# EAGLE design with_usb_small_smd (EAGLE 8.3.2)
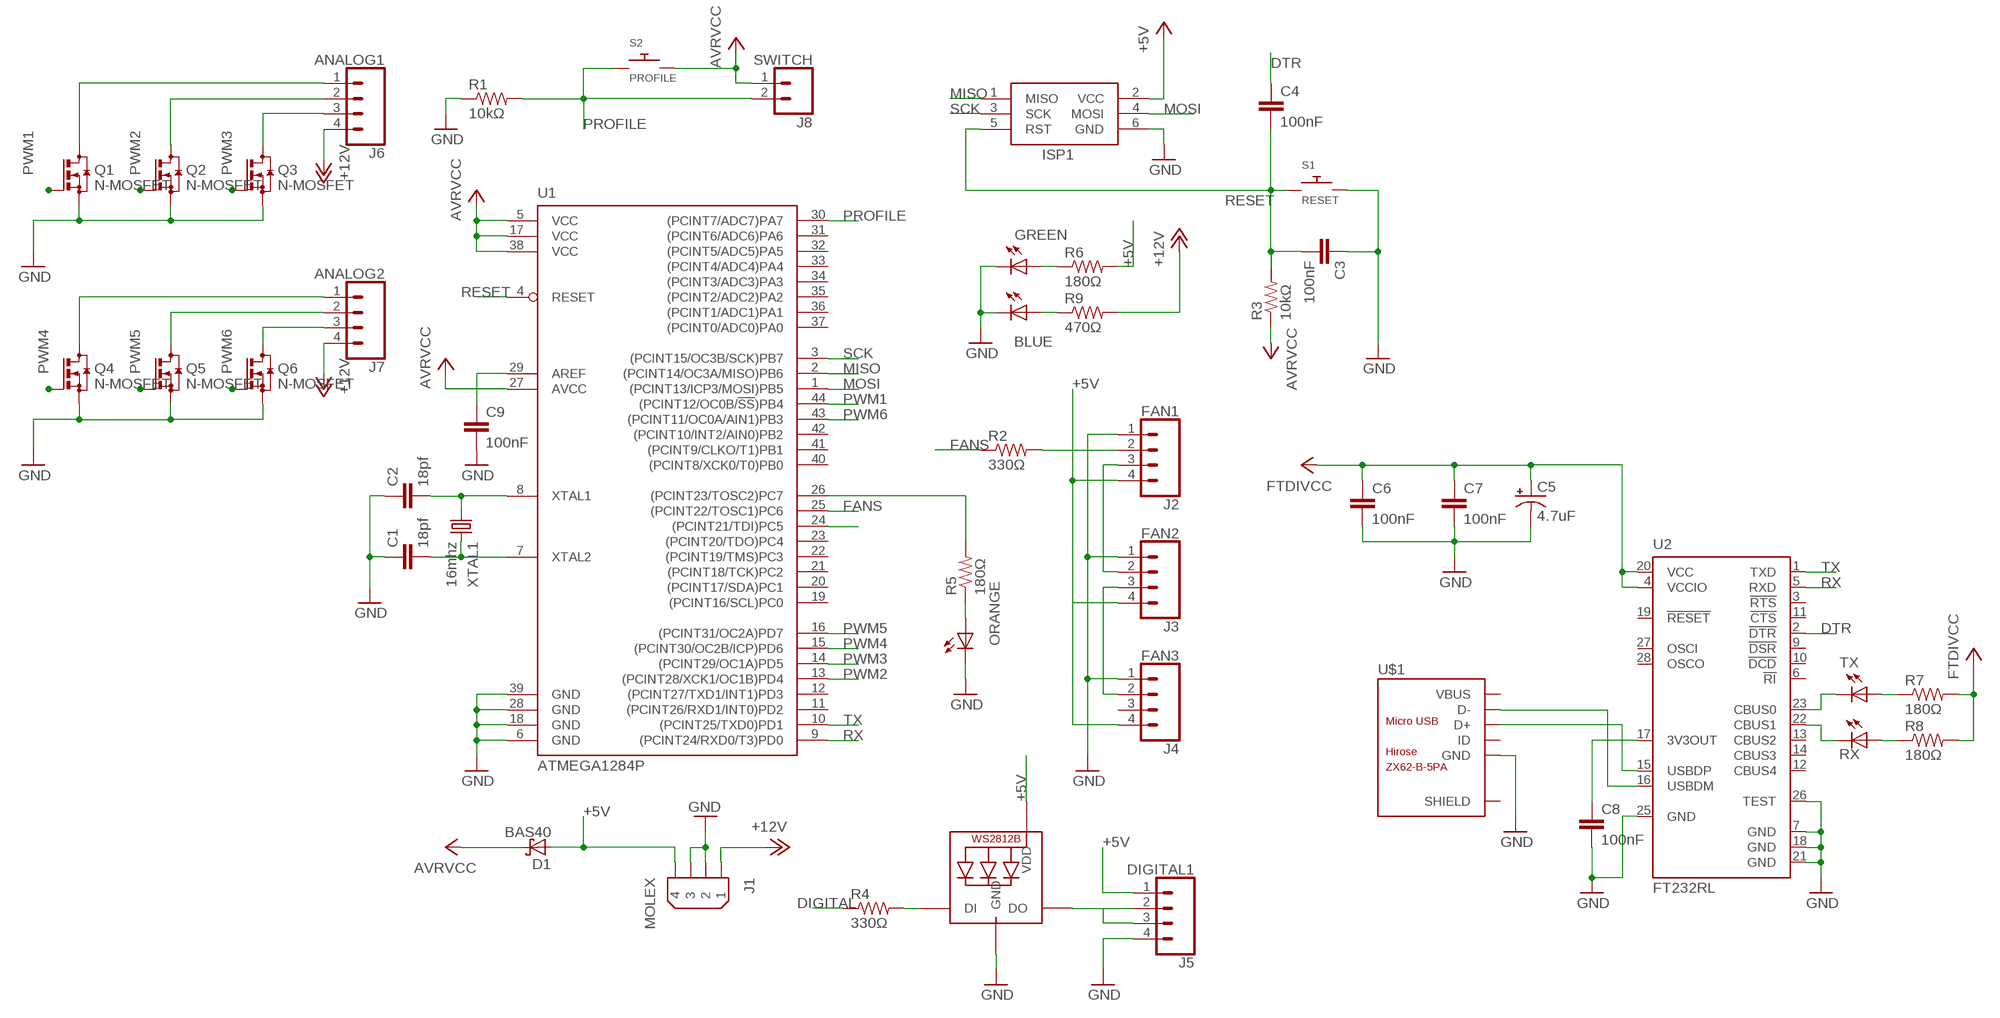
[diagram p0: schematic, sheet 1]

## Parts
C1  18pf  C-EUC0805  [C0805]
C2  18pf  C-EUC0805  [C0805]
C3  100nF  C-EUC0805  [C0805]
C4  100nF  C-EUC0805  [C0805]
C5  4.7uF  CPOL-US153CLV-0405  [153CLV-0405]
C6  100nF  C-EUC0805  [C0805]
C7  100nF  C-EUC0805  [C0805]
C8  100nF  C-EUC0805  [C0805]
C9  100nF  C-EUC0805  [C0805]
D1  BAS40  [SOT23]
ISP1  AVRISP-6  [AVRISP]
J1  MOLEX  9090-4R  [9090-4R]
J2  FAN1  TJC8-4P  [TJC8-4P]
J3  FAN2  TJC8-4P  [TJC8-4P]
J4  FAN3  TJC8-4P  [TJC8-4P]
J5  DIGITAL1  MX-22-05-3041  [MX-22-05-3041]
J6  ANALOG1  MX-22-05-3041  [MX-22-05-3041]
J7  ANALOG2  MX-22-05-3041  [MX-22-05-3041]
J8  SWITCH  TE-280377-1  [TE-280377-1]
LED1  TX  LEDSML0805  [SML0805]
LED2  RX  LEDSML0805  [SML0805]
LED3  GREEN  LEDSML0805  [SML0805]
LED4  BLUE  LEDSML0805  [SML0805]
LED5  ORANGE  LEDSML0805  [SML0805]
LED6  WS2812B  [WS2812B]
Q1  N-MOSFET  [SOT23]
Q2  N-MOSFET  [SOT23]
Q3  N-MOSFET  [SOT23]
Q4  N-MOSFET  [SOT23]
Q5  N-MOSFET  [SOT23]
Q6  N-MOSFET  [SOT23]
R1  10kΩ  R-US_R0805  [R0805]
R2  330Ω  R-US_R0805  [R0805]
R3  10kΩ  R-US_R0805  [R0805]
R4  330Ω  R-US_R0805  [R0805]
R5  180Ω  R-US_R0805  [R0805]
R6  180Ω  R-US_R0805  [R0805]
R7  180Ω  R-US_R0805  [R0805]
R8  180Ω  R-US_R0805  [R0805]
R9  470Ω  R-US_R0805  [R0805]
S1  RESET  BUTTON  [B3F-1000]
S2  PROFILE  BUTTON  [B3F-1000]
U1  ATMEGA1284P  ATMEGA1284P-AU  [TQFP44]
U2  FT232RL  [SSOP28]
U$1  MICRO_USB  [MICRO_USB]
XTAL1  16mhz  CRYSTALHC49U-V  [HC49U-V]

## Nets
+5V: C5.+ C6.1 C7.1 D1.1(A) J1.4 J2.4 J3.4 J4.4 J5.1 LED6.1-VDD(VDD) R6.2 R7.2 R8.2 U2.4(VCCIO) U2.20(VCC) ; supply symbol labelled FTDIVCC
+12V: J1.1 J6.4 J7.4 R9.2
AVR: D1.3(C) ISP1.2(VCC) J8.1 R3.1 S2.3 S2.4 U1.5(VCC) U1.17(VCC) U1.27(AVCC) U1.38(VCC) ; supply symbol labelled AVRVCC, +5V
D+: U2.15(USBDP) U$1.3(D+)
D-: U2.16(USBDM) U$1.2(D-)
DIGITAL: R4.1 U1.24((PCINT21/TDI)PC5)
DIN-D: J5.2 J5.3 LED6.2-DOUT(DO)
DTR: C4.1 U2.2(!DTR)
F1-DIN: J2.2 R2.2
F2-DIN: J2.3 J3.2
F3-DIN: J3.3 J4.2
FANS: R2.1 U1.25((PCINT22/TOSC1)PC6)
GND: C1.1 C2.1 C3.1 C5.- C6.2 C7.2 C8.2 C9.2 ISP1.6(GND) J1.2 J1.3 J2.1 J3.1 J4.1 J5.4 LED3.C LED4.C LED5.C LED6.3-GND(GND) Q1.2(S) Q2.2(S) Q3.2(S) Q4.2(S) Q5.2(S) Q6.2(S) R1.1 S1.3 S1.4 U1.6(GND) U1.18(GND) U1.28(GND) U1.39(GND) U2.7(GND) U2.18(GND) U2.21(GND) U2.25(GND) U2.26(TEST) U$1.5(GND)
LED: R5.2 U1.26((PCINT23/TOSC2)PC7)
MISO: ISP1.1(MISO) U1.2((PCINT14/OC3A/MISO)PB6)
MOSI: ISP1.4(MOSI) U1.1((PCINT13/ICP3/MOSI)PB5)
N$2: LED1.A R7.1
N$3: C8.1 U2.17(3V3OUT)
N$4: LED2.A R8.1
N$5: LED4.A R9.1
N$6: C9.1 U1.29(AREF)
N$7: LED3.A R6.1
N$8: LED5.A R5.1
N$9: LED6.4-DIN(DI) R4.2
PROFILE: J8.2 R1.2 S2.1 S2.2 U1.30((PCINT7/ADC7)PA7)
PWM1: Q1.1(G) U1.44((PCINT12/OC0B/!SS!)PB4)
PWM2: Q2.1(G) U1.13((PCINT28/XCK1/OC1B)PD4)
PWM3: Q3.1(G) U1.14((PCINT29/OC1A)PD5)
PWM4: Q4.1(G) U1.15((PCINT30/OC2B/ICP)PD6)
PWM5: Q5.1(G) U1.16((PCINT31/OC2A)PD7)
PWM6: Q6.1(G) U1.43((PCINT11/OC0A/AIN1)PB3)
RESET: C3.2 C4.2 ISP1.5(RST) R3.2 S1.1 S1.2 U1.4(RESET)
RX: U1.9((PCINT24/RXD0/T3)PD0) U2.5(RXD)
RXLED: LED2.C U2.22(CBUS1)
S1-1: J6.1 Q1.3(D)
S1-2: J6.2 Q2.3(D)
S1-3: J6.3 Q3.3(D)
S2-1: J7.1 Q4.3(D)
S2-2: J7.2 Q5.3(D)
S2-3: J7.3 Q6.3(D)
SCK: ISP1.3(SCK) U1.3((PCINT15/OC3B/SCK)PB7)
TX: U1.10((PCINT25/TXD0)PD1) U2.1(TXD)
TXLED: LED1.C U2.23(CBUS0)
XTAL1: C2.2 U1.8(XTAL1) XTAL1.1
XTAL2: C1.2 U1.7(XTAL2) XTAL1.2
Unconnected: J4.3 U1.11((PCINT26/RXD1/INT0)PD2) U1.12((PCINT27/TXD1/INT1)PD3) U1.19((PCINT16/SCL)PC0) U1.20((PCINT17/SDA)PC1) U1.21((PCINT18/TCK)PC2) U1.22((PCINT19/TMS)PC3) U1.23((PCINT20/TDO)PC4) U1.31((PCINT6/ADC6)PA6) U1.32((PCINT5/ADC5)PA5) U1.33((PCINT4/ADC4)PA4) U1.34((PCINT3/ADC3)PA3) U1.35((PCINT2/ADC2)PA2) U1.36((PCINT1/ADC1)PA1) U1.37((PCINT0/ADC0)PA0) U1.40((PCINT8/XCK0/T0)PB0) U1.41((PCINT9/CLKO/T1)PB1) U1.42((PCINT10/INT2/AIN0)PB2) U2.3(!RTS) U2.6(!RI) U2.9(!DSR) U2.10(!DCD) U2.11(!CTS) U2.12(CBUS4) U2.13(CBUS2) U2.14(CBUS3) U2.19(!RESET) U2.27(OSCI) U2.28(OSCO) U$1.1(VBUS) U$1.4(ID) U$1.S1(SHIELD) U$1.S2(SHIELD) U$1.S3(SHIELD) U$1.S4(SHIELD) U$1.S5(SHIELD) U$1.S6(SHIELD)

## Library data of the parts
C1 C3 C4 = rcl:C-EU: CAPACITOR, European symbol
C2 C6-C9 = resistor:C-EU: CAPACITOR, European symbol
C5 = resistor:CPOL-US: POLARIZED CAPACITOR, American symbol
D1 = diode:BAS40: Silicon Schottky Diodes General-purpose diode for high-speed switching
ISP1 = my_parts:AVRISP: AVR ISP HEADER Standard 6 pin header for AVR programming
J1 = con-thomas-betts:9090-4: Disk Drive Power four position Source: Thomas & Betts Electronic Interconnects Eiropean Edition 1998; OC_FARNELL: unknown; OC_NEWARK: unknown
J2-J4 = my_parts:TJC8-4P
J5-J7 = my_parts:MX-22-05-3041
J8 = my_parts:TE-280377-1
LED1-LED5 = led:LED: LED OSRAM: - CHIPLED LG R971, LG N971, LY N971, LG Q971, LY Q971, LO R971, LY R971 LH N974, LH R974 LS Q976, LO Q976, LY Q976 LO Q996 - Hyper CHIPLED LW Q18S LB Q993, LB Q99A, LB R99A - SideLED LS A670, LO A670, LY A670, LG A670, LP A670 LB A673, LV A673, LT A673, LW A673 LH A674 LY A675 LS A676, LA A676, LO A676, LY A676, LW A676 LS A679, LY A679, LG A679 - Hyper Micro SIDELED® LS Y876, LA Y876, LO Y876, LY Y876 LT Y87S - SmartLED LW L88C, LW L88S LB L89C, LB L89S, LG L890 LS L89K, LO L89K, LY L89K LS L896, LA L896, LO L896, LY L896 - TOPLED LS T670, LO T670, LY T670, LG T670, LP T670 LSG T670, LSP T670, LSY T670, LOP T670, LYG T670 LG T671, LOG T671, LSG T671 LB T673, LV T673, LT T673, LW T673 LH T674 LS T676, LA T676, LO T676, LY T676, LB T676, LH T676, LSB T676, LW T676 LB T67C, LV T67C, LT T67C, LS T67K, LO T67K, LY T67K, LW E67C LS E67B, LA E67B, LO E67B, LY E67B, LB E67C, LV E67C, LT E67C LW T67C LS T679, LY T679, LG T679 LS T770, LO T770, LY T770, LG T770, LP T770 LB T773, LV T773, LT T773, LW T773 LH T774 LS E675, LA E675, LY E675, LS T675 LS T776, LA T776, LO T776, LY T776, LB T776 LHGB T686 LT T68C, LB T68C - Hyper Mini TOPLED® LB M676 - Mini TOPLED Santana® LG M470 LS M47K, LO M47K, LY M47K Source: http://www.osram.convergy.de LUXEON: - LUMILED® LXK2-PW12-R00, LXK2-PW12-S00, LXK2-PW14-U00, LXK2-PW14-V00 LXK2-PM12-R00, LXK2-PM12-S00, LXK2-PM14-U00 LXK2-PE12-Q00, LXK2-PE12-R00, LXK2-PE12-S00, LXK2-PE14-T00, LXK2-PE14-U00 LXK2-PB12-K00, LXK2-PB12-L00, LXK2-PB12-M00, LXK2-PB14-N00, LXK2-PB14-P00, LXK2-PB14-Q00 LXK2-PR12-L00, LXK2-PR12-M00, LXK2-PR14-Q00, LXK2-PR14-R00 LXK2-PD12-Q00, LXK2-PD12-R00, LXK2-PD12-S00 LXK2-PH12-R00, LXK2-PH12-S00 LXK2-PL12-P00, LXK2-PL12-Q00, LXK2-PL12-R00 Source: www.luxeon.com KINGBRIGHT: KA-3528ASYC Source: www.kingbright.com
LED6 = my_parts:WS2812B
Q1-Q6 = my_parts:N-MOSFET
R1-R9 = resistor:R-US_: RESISTOR, American symbol
S1 S2 = my_parts:BUTTON
U1 = my_parts:ATMEGA1284P-AU
U2 = ftdichip:FT232R: Source: http://www.ftdichip.com/Documents/DataSheets/DS_FT232R_v104.pdf; MPN: FT232RL; OC_FARNELL: 1146032; OC_NEWARK: 91K9918
U$1 = my_parts:MICRO_USB
XTAL1 = adafruit:CRYSTAL: CRYSTAL; OC_FARNELL: 1666969; OC_NEWARK: unknown

## Net classes
0 default: clearance 0.152 mm
1 GND: clearance 0.61 mm

## Board
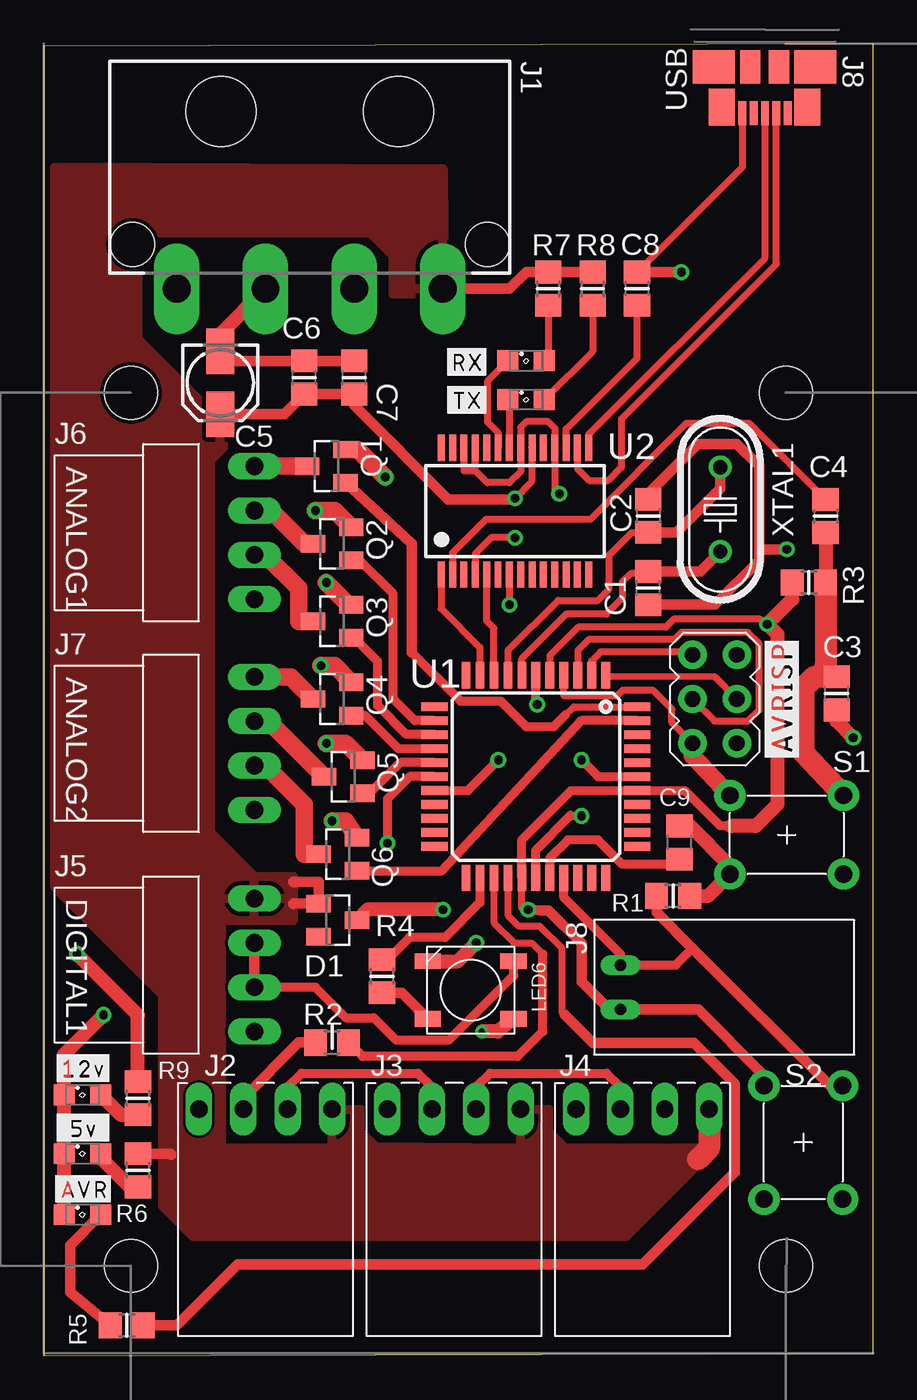
[diagram p1: board, top side]
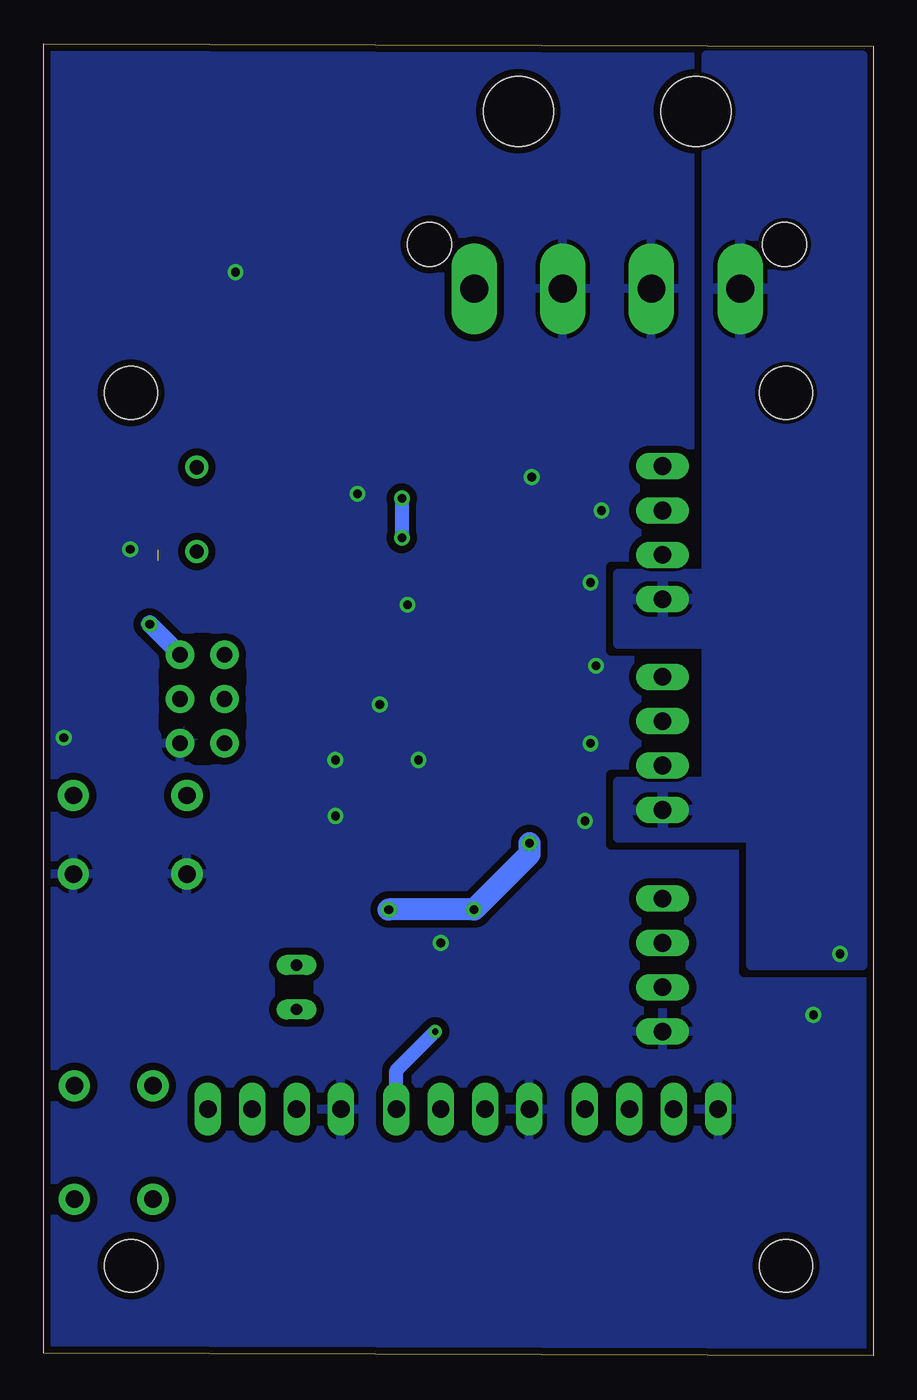
[diagram p2: board, bottom side, seen from below]

Size 47.5 x 75.16 mm. Coordinates in mm from the lower left corner, seen from the top.
Outline: 0,0 47.5,0.16 47.5,75.16 0,75 0,0
Copper layers (1*16): Top 0.035mm / dielectric 1.5mm / Bottom 0.035mm
Design rules "default *": minimum track width 6mil, minimum drill 0.35mm, track to track 6mil, track to pad 6mil, pad to pad 6mil, via to via 6mil, smd to smd 6mil, copper to edge 10mil, drill to drill 6mil, minimum pad ring 10mil, minimum via ring 8mil, stop-mask expansion 4mil, vias tented up to drill 0mil, thermal gap 10mil
Holes 3 mm at 42.5,5.16 42.5,55.16 5,55.16 5,5.16
bRestrict: area 32.8,21 to 33.5,21.2; area 36.5,36 to 36.8,36.7; area 40,36 to 40.3,36.7; area 40,38.6 to 40.3,39.2; area 38.1,40.5 to 38.7,40.8; area 36.5,38.6 to 36.8,39.2; area 38.1,34.4 to 38.7,34.8

### Footprints (pad centres in the part's own frame; a part is rotated, then mirrored left to right if it is on the bottom)
C0805 = smd 1.3 x 1.5: 1 -0.95,0; 2 0.95,0
153CLV-0405 = smd 2.6 x 1.6: + 1.8,0; - -1.8,0
SOT23 = smd 1 x 1.4: 1 -0.95,-1.1; 2 0.95,-1.1; 3 0,1.1
AVRISP = drill 0.9 pad 1.626: 1 -1.27,2.54; 2 1.27,2.54; 3 -1.27,0; 4 1.27,0; 5 -1.27,-2.54; 6 1.27,-2.54
9090-4R = drill 1.6 pad 2.6 long: 1 -7.62,-6.35; 2 -2.54,-6.35; 3 2.54,-6.35; 4 7.62,-6.35 | hole 4: -5.08,3.81; 5.08,3.81 | hole 2.5: -10.16,-3.81; 10.16,-3.81
TJC8-4P = drill 1 long: 1 3.81,0; 2 1.27,0; 3 -1.27,0; 4 -3.81,0
MX-22-05-3041 = drill 1.016 long: 1 3.81,0; 2 1.27,0; 3 -1.27,0; 4 -3.81,0
TE-280377-1 = drill 0.65 long: 1 1.27,0; 2 -1.27,0
SML0805 = smd 1.2 x 1.2: A 1.05,0; C -1.05,0
WS2812B = smd 1.5 x 0.9: 1-VDD 2.45,-1.65; 2-DOUT 2.45,1.65; 3-GND -2.45,1.65; 4-DIN -2.45,-1.65
R0805 = smd 1.3 x 1.5: 1 -0.95,0; 2 0.95,0
B3F-1000 = drill 1 pad 1.778: 1 -3.25,2.25; 2 3.25,2.25; 3 -3.25,-2.25; 4 3.25,-2.25
TQFP44 = smd 1.5 x 0.5: 1 -5.8,4; 2 -5.8,3.2; 3 -5.8,2.4; 4 -5.8,1.6; 5 -5.8,0.8; 6 -5.8,0; 7 -5.8,-0.8; 8 -5.8,-1.6; 9 -5.8,-2.4; 10 -5.8,-3.2; 11 -5.8,-4; 23 5.8,-4; 24 5.8,-3.2; 25 5.8,-2.4; 26 5.8,-1.6; 27 5.8,-0.8; 28 5.8,0; 29 5.8,0.8; 30 5.8,1.6; 31 5.8,2.4; 32 5.8,3.2; 33 5.8,4 | smd 0.5 x 1.5: 12 -4,-5.8; 13 -3.2,-5.8; 14 -2.4,-5.8; 15 -1.6,-5.8; 16 -0.8,-5.8; 17 0,-5.8; 18 0.8,-5.8; 19 1.6,-5.8; 20 2.4,-5.8; 21 3.2,-5.8; 22 4,-5.8; 34 4,5.8; 35 3.2,5.8; 36 2.4,5.8; 37 1.6,5.8; 38 0.8,5.8; 39 0,5.8; 40 -0.8,5.8; 41 -1.6,5.8; 42 -2.4,5.8; 43 -3.2,5.8; 44 -4,5.8
SSOP28 = smd 0.4 x 1.5: 1 -4.225,-3.625; 2 -3.575,-3.625; 3 -2.925,-3.625; 4 -2.275,-3.625; 5 -1.625,-3.625; 6 -0.975,-3.625; 7 -0.325,-3.625; 8 0.325,-3.625; 9 0.975,-3.625; 10 1.625,-3.625; 11 2.275,-3.625; 12 2.925,-3.625; 13 3.575,-3.625; 14 4.225,-3.625; 15 4.225,3.625; 16 3.575,3.625; 17 2.925,3.625; 18 2.275,3.625; 19 1.625,3.625; 20 0.975,3.625; 21 0.325,3.625; 22 -0.325,3.625; 23 -0.975,3.625; 24 -1.625,3.625; 25 -2.275,3.625; 26 -2.925,3.625; 27 -3.575,3.625; 28 -4.225,3.625
MICRO_USB = smd 0.45 x 1.38: 1 1.325,-2.65; 2 0.675,-2.65; 3 0.025,-2.65; 4 -0.625,-2.65; 5 -1.275,-2.65 | smd 1.5 x 2.1: S1 -2.45,-2.3; S2 2.45,-2.3 | smd 2.4 x 1.9: S3 -2.9,0; S4 2.9,0 | smd 1.15 x 1.9: S5 -0.825,0; S6 0.825,0
HC49U-V = drill 0.813: 1 -2.413,0; 2 2.413,0

### Placement (x,y rotation side)
C1  34.61,43.97 90 top
C2  34.61,48.11 270 top
C3  45.4,37.94 90 top
C4  44.77,48.1 270 top
C5  10.11,55.73 270 top
C6  14.92,56.04 90 top
C7  17.78,56.04 90 top
C8  33.97,61.12 90 top
C9  36.4,29.4 90 top
D1  16.85,24.95 270 top
ISP1  38.42,37.62 0 top
J1  15.24,67.47 0 top
J2  12.7,14.13 180 top
J3  23.5,14.13 180 top
J4  34.29,14.13 180 top
J5  12.06,22.38 90 top
J6  12.06,47.15 90 top
J7  12.06,35.08 90 top
J8  33.02,21.11 270 top
LED1  27.62,56.99 0 top
LED2  27.62,54.77 0 top
LED3  2.22,11.59 0 top
LED4  2.22,14.95 0 top
LED5  2.22,8.09 0 top
LED6  24.45,20.95 0 top
Q1  16.19,50.96 90 top
Q2  16.51,46.51 90 top
Q3  16.51,42.07 90 top
Q4  16.51,37.62 90 top
Q5  17.14,33.18 90 top
Q6  16.83,28.73 90 top
R1  36.04,26.35 180 top
R2  16.51,17.94 180 top
R3  43.81,44.29 0 top
R4  19.37,21.75 270 top
R5  4.76,1.74 0 top
R6  5.4,10.63 90 top
R7  28.89,61.12 90 top
R8  31.43,61.12 90 top
R9  5.4,14.76 90 top
S1  42.55,29.84 0 top
S2  43.49,12.22 270 top
U1  28.18,33.18 270 top
U2  26.99,48.38 0 top
U$1  41.27,73.82 0 top
XTAL1  38.73,48.48 270 top

### Tracks (layer width: path | path; a pad name or v marks a point on that pad's centre or on a via)
+5V  (via drill 0.35, 0.5)
  Top 0.406: U2.4 24.71,45.95 25.62,46.85 v26.99,46.85 | U2.20 27.96,52.02 27.94,52.05 27.94,50.06 v26.99,49.11
  Top 0.61: 14.29,25.87 14.31,25.9 D1.1 15.75,27.14 14.29,27.14 | R6.2 7.24,11.58 7.31,11.51 | C5.+ 13.77,53.93 C6.1 C7.1 17.78,54.45 23.18,49.05 26.93,49.05 v26.99,49.11 | J1.4 26.67,61.12 27.62,62.07 R7.2 R8.2
  Top 0.813: LED6.1-VDD 26.01,18.57 v25.08,18.57
  Top 1.27: J4.4 38.1,11.9 37.47,11.27
  Bottom 0.813: J3.4 27.3,16.35 v25.08,18.57 | v26.99,49.11 v26.99,46.85
  pour Top: 0.64,26.83 0.64,68.1 22.87,67.99 22.95,60.74 20,60.8 20,63.02 18.73,64.29 5.4,64.29 5.4,58.26 10.79,52.86 10.79,52.54 9.53,51.27 9.53,30 12.06,27.46 14.29,27.46 14.29,24.92 10.16,24.92 10.16,11.9 16.51,11.9 16.51,14.13 18.1,14.13 18.1,12.86 18.98,11.99 27.3,11.9 27.3,14.13 28.89,14.13 28.89,12.86 29.84,11.9 38.42,11.9 33.34,6.82 8.57,6.82 6.82,8.57 6.83,20.63
+12V  (via drill 0.5)
  Top 0.813: R9.2 5.4,19.52 v1.91,23.02
  pour Bottom: 9.53,32.86 9.53,40.8 14.61,40.8 14.61,44.77 9.53,44.77 9.53,74.45 0.64,74.45 0.64,22.38 6.99,22.38 6.99,29.68 14.61,29.68 14.61,32.86
AVR  (via drill 0.5)
  Top 0.406: v41.43,41.9 40.96,42.22 36.11,42.22 35.63,41.74 30.61,41.74 28.98,40.11 U1.5 | 27.43,27.43 U1.27 | v27.74,25.56 27.38,25.61 U1.27
  Top 0.508: 39.36,30.34 38.74,30.35 36.72,32.38 U1.38 30.2,32.38 27.38,29.55 U1.27 | v19.68,29.37 19.68,31.91 20.95,33.18 U1.17
  Top 0.61: S2.3 41.24,16.06 37.47,19.84 J8.1 32.38,19.84 30.8,21.43 30.8,23.62 28.9,25.52 28.4,25.52 v27.74,25.56
  Top 0.813: R3.1 42.87,43.34 v41.43,41.9 42.01,41.33 42.01,31.58 40.76,30.34 39.36,30.34 | v22.86,25.56 18.55,25.56 D1.3
  Bottom 1.016: v41.43,41.9 ISP1.2
  Bottom 1.27: v27.74,25.56 v22.86,25.56 19.68,28.73 v19.68,29.37
D+
  Top 0.406: U2.15 31.21,52.8 41.3,62.88 U$1.3
D-
  Top 0.406: 41.44,62.02 41.22,61.8 | 41.22,61.8 33.08,53.65 33.08,50.9 32.32,50.14 31.25,50.14 30.56,50.83 U2.16 | 41.22,61.8 41.95,62.53 U$1.2
DIGITAL
  Top 0.406: R4.1 19.37,23.02 20,23.02
  Top 0.508: 20,23.02 20.95,23.97 22.98,23.97 24.98,25.96 U1.24
DIN-D
  Top 0.508: J5.3 15.56,21.11 17.3,19.37 18.89,19.37 20.16,18.1 23.23,18.1 26.91,21.78 26.91,22.27 26.9,22.29 LED6.2-DOUT
  Top 0.61: J5.3 J5.2
DTR
  Top 0.406: 44.3,49.05 C4.1 40.4,53.42 36.8,53.42 31.29,47.9 25.32,47.9 23.41,46 U2.2
F1-DIN
  Top 0.61: J2.2 11.43,14.76 14.61,17.94 R2.2
F2-DIN
  Top 0.508: J2.3 13.97,15.4 14.77,16.19 21.43,16.19 22.23,15.4 J3.2
F3-DIN
  Top 0.508: 24.77,15.4 25.56,16.19 32.22,16.19 33.02,15.4 J4.2
  Top 0.61: J3.3 24.77,15.4
FANS
  Top 0.406: 28.57,23.02 27.94,23.65 26.93,23.65 25.78,24.8 U1.25
  Top 0.508: 28.57,23.02 28.57,18.58 27.14,17.14 18.26,17.14 R2.1
GND  (via drill 0.5)  (1 unrouted)
  Top 0.406: U2.7 26.66,43.34 v26.67,43.02 | 29.27,52.01 U2.18 | U$1.5 40,68.09 C8.2 | U2.18 29.26,53.13 28.89,53.5 27.62,53.5 27.31,53.19 U2.21 27.3,51.99 27.3,50.64 26.67,50 25.4,50 24.71,50.69 | 24.71,50.69 U2.25 | U2.26 24.06,50.69 24.71,50.69 | U2.18 29.26,49.63 v29.53,49.37
  Top 0.508: U1.6 28.18,37.38 v28.26,37.3 | v30.8,34.13 31.75,33.18 U1.39 | U1.28 28.18,28.95 30.16,30.95 v30.79,30.93 | U1.18 24.28,32.38 v26.04,34.13
  Top 0.61: C2.1 34.61,49.38 37.45,52.23 39.69,52.23 40.96,50.96 40.96,45.56 38.42,43.02 C1.1 34.92,43.34 | C8.2 v36.51,62.07 | C7.2 C6.2 10.65,56.99 C5.- | 40.96,46.19 v42.55,46.19
  Top 0.813: C3.1 45.4,36.35 v46.35,35.4 | LED6.3-GND 23.71,22.6 v24.77,23.65 | v3.43,19.52 1.17,17.27 LED4.C LED3.C LED5.C | C9.2 37.01,30.35 39.3,28.07 S1.3 38.05,26.35 R1.1 | J1.2 10.11,58.53 C5.-
  Top 1.016: Q6.2 17.29,30.64 v16.51,30.64 | Q5.2 17.29,35.08 v16.19,35.08 | Q4.2 16.66,39.53 v15.88,39.53 | Q2.2 16.66,48.42 v15.56,48.42 | Q1.2 17.98,51.91 v19.55,50.33 | Q3.2 17.46,43.02 v16.19,44.29
  pour Bottom (isolate 0.406, rank 2): 0,75.16 47.5,75.16 47.5,0.16 0,0.16
LED
  Top 0.406: 29.84,19.52 29.68,19.68 29.68,23.33 28.41,24.6 27.21,24.6 26.6,25.2 26.6,27.35 U1.26
  Top 0.61: R5.2 7.62,1.74 11.11,5.24 34.29,5.24 39.57,10.51 39.57,15.59 37.22,17.94 31.43,17.94 29.84,19.52
MISO
  Top 0.406: U1.2 31.38,39.8 31.89,40.32 36.99,40.32 ISP1.1
MOSI
  Top 0.406: ISP1.4 38.41,38.9 32.36,38.89 U1.1
N$1
  pour Bottom (rank 2): 10.16,11.27 37.78,11.27 37.78,1.11 9.84,1.43 9.84,10.95
N$2
  Top 0.406: R7.1 28.89,57.21 LED1.A
N$3
  Top 0.406: U2.17 29.91,53.08 33.97,57.14 C8.1
N$4
  Top 0.406: R8.1 31.43,57.53 LED2.A
N$5
  Top 0.813: LED4.A 4.41,13.81 R9.1
N$6
  Top 0.508: C9.1 36.11,28.16 33.14,28.16 31.74,29.56 30.03,29.56 28.98,28.51 U1.29
N$7
  Top 0.813: LED3.A 3.27,11.35 4.94,9.68 R6.1
N$8
  Top 0.61: R5.1 1.52,3.65 1.52,6.34 LED5.A
N$9
  Top 0.61: R4.2 20.5,20.8 LED6.4-DIN
PROFILE
  Top 0.508: U1.30 29.78,26.26 33.02,23.02 J8.2 36.2,22.38 37.15,23.33
  Top 0.61: R1.2 35.09,25.39 37.15,23.33 45.09,15.4 45.67,15.4 S2.1
PWM1
  Top 0.406: 21.08,43.97 21.08,44.1 | 29.87,36.72 30.35,37.18 U1.44
  Top 0.508: 21.08,40.29 23.88,37.49 26.16,37.49 27.62,36.03 29.21,36.03 29.87,36.72
  Top 0.61: 21.08,40.29 21.08,43.97 21.08,46.53 Q1.1
PWM2
  Top 0.406: 22.36,36.35 U1.13 | 18.09,45.56 Q2.1
  Top 0.508: 18.09,45.56 20,43.65 20,37.62 21.25,36.38 U1.13
PWM3
  Top 0.406: 17.93,40.97 Q3.1 | U1.14 22.37,35.59
  Top 0.508: 17.93,40.97 19.11,39.78 19.11,37.24 20.77,35.59 22.37,35.59
PWM4
  Top 0.406: U1.15 22.37,34.76 | 17.78,36.67 Q4.1
  Top 0.508: 17.78,36.67 18.41,36.67 20.32,34.76 22.37,34.76
PWM5
  Top 0.406: U1.16 22.34,33.94
  Top 0.508: U1.16 20.42,33.98 18.67,32.23 Q5.1
PWM6
  Top 0.508: Q6.1 22.8,27.78 30.77,36.38 U1.43
RESET
  Top 0.406: ISP1.5 35.97,36.26 35.97,37.04 34.89,38.12 33.14,38.12 32.82,37.8 29.78,37.8 U1.4
  Top 0.61: C4.2
  Top 0.813: C4.2 R3.2
  Top 1.016: S1.1 37.15,34.4 ISP1.5
  Top 1.27: S1.2 43.5,34.55 43.5,38.26 44.13,38.89 C3.2 C3.2 arc-90 44.77,39.53 R3.2
RX
  Top 0.406: U2.5 25.36,42.09 25.78,41.67 U1.9
RXLED
  Top 0.406: LED2.C 26.66,54.36 U2.22
S1-1
  Top 1.016: Q1.3 J6.1
S1-2
  Top 1.016: Q2.3 14.92,46.51 13.02,48.42 J6.2
S1-3
  Top 1.016: Q3.3 14.61,42.07 14.61,43.97 12.7,45.88 J6.3
S2-1
  Top 1.016: Q4.3 14.14,38.89 J7.1
S2-2
  Top 1.016: Q5.3 12.87,36.35 J7.2
S2-3
  Top 0.813: Q6.3 14.92,28.73
  Top 1.016: 14.92,28.73 14.92,31.59 12.7,33.81 J7.3
SCK
  Top 0.406: ISP1.3 38.42,36.35 40.32,36.35 40.96,36.99 40.96,40.8 40.32,41.43 36.51,41.43 36.1,41.02 31.2,41.02 30.58,40.4 U1.3
TX
  Top 0.406: U2.1 22.76,42.79 24.98,40.57 U1.10
TXLED
  Top 0.406: 26.01,52.23 26.01,52.88 | 26.01,52.23 U2.23 | LED1.C 25.4,55.82 25.4,53.5 26.01,52.88 | 26.01,52.88 26.01,52.23
XTAL1
  Top 0.406: U1.8 26.58,40.4 29.45,43.27 31.73,43.27 32.38,43.93 32.38,45.87 33.66,47.15 C2.2
  Top 0.61: C2.2 36.21,47.16 38.73,49.69 XTAL1.1
XTAL2
  Top 0.406: U1.7 27.38,39.93 29.93,42.48 32.22,42.48 33.14,43.41 33.14,44.34 33.6,44.81 34.49,44.81 C1.2 34.49,44.96
  Top 0.61: C1.2 37.59,44.92 XTAL1.2

### Text on the board
tNames: J8 | USB
bRestrict: LED Controller | by RouNdeL